# Altium schematic sheet ME6211A33M3G-N.SchDoc
size 292 x 193 mm
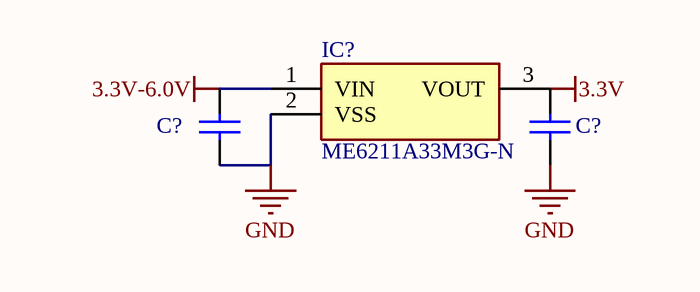
[diagram p0: ME6211A33M3G-N.SchDoc]

## Parts
(Parts that share a designator on the sheet are numbered #1, #2 ... from top to bottom, then left to right.)
C?#1  1uF  [CAP-0603]  (value not drawn)
C?#2  1uF  [CAP-0603]  (value not drawn)
IC?  ME6211A33M3G-N  [SOT-23-3]

## Nets
3.3V: C?#2.2 IC?.3(VOUT)
3.3V-6.0V: C?#1.2 IC?.1(VIN)
GND: C?#1.1 C?#2.1 IC?.2(VSS)

## Library data of the parts
C?#1 C?#2 = CAP: 贴片电容; ComponentLink1Description: 供应商链接; ComponentLink1URL: http://www.szlcsc.com/product/details_53938.html; Package: 0402; Supplier: LC; SuppliersPartNumber: C52923
IC? = ME6211A33M3G-N: 线性稳压; Manufacturer_Name: Nexperia; Manufacturer_Part_Number: SI2302DS; Datasheet Link: https://assets.nexperia.com/documents/data-sheet/SI2302DS.pdf; Height: 1.1mm; Mouser Part Number: N/A; Mouser Price/Stock: https://www.mouser.com/Search/Refine.aspx?Keyword=N%2FA; RS Part Number: 7983053P; RS Price/Stock: http://uk.rs-online.com/web/p/products/7983053P